# Altium schematic sheet MSXII_DC-DC_Converter.SchDoc: MSXII DC-DC Converter
size Letter; SheetNumber: 1; SheetTotal: 1; Website: www.uwmidsun.com
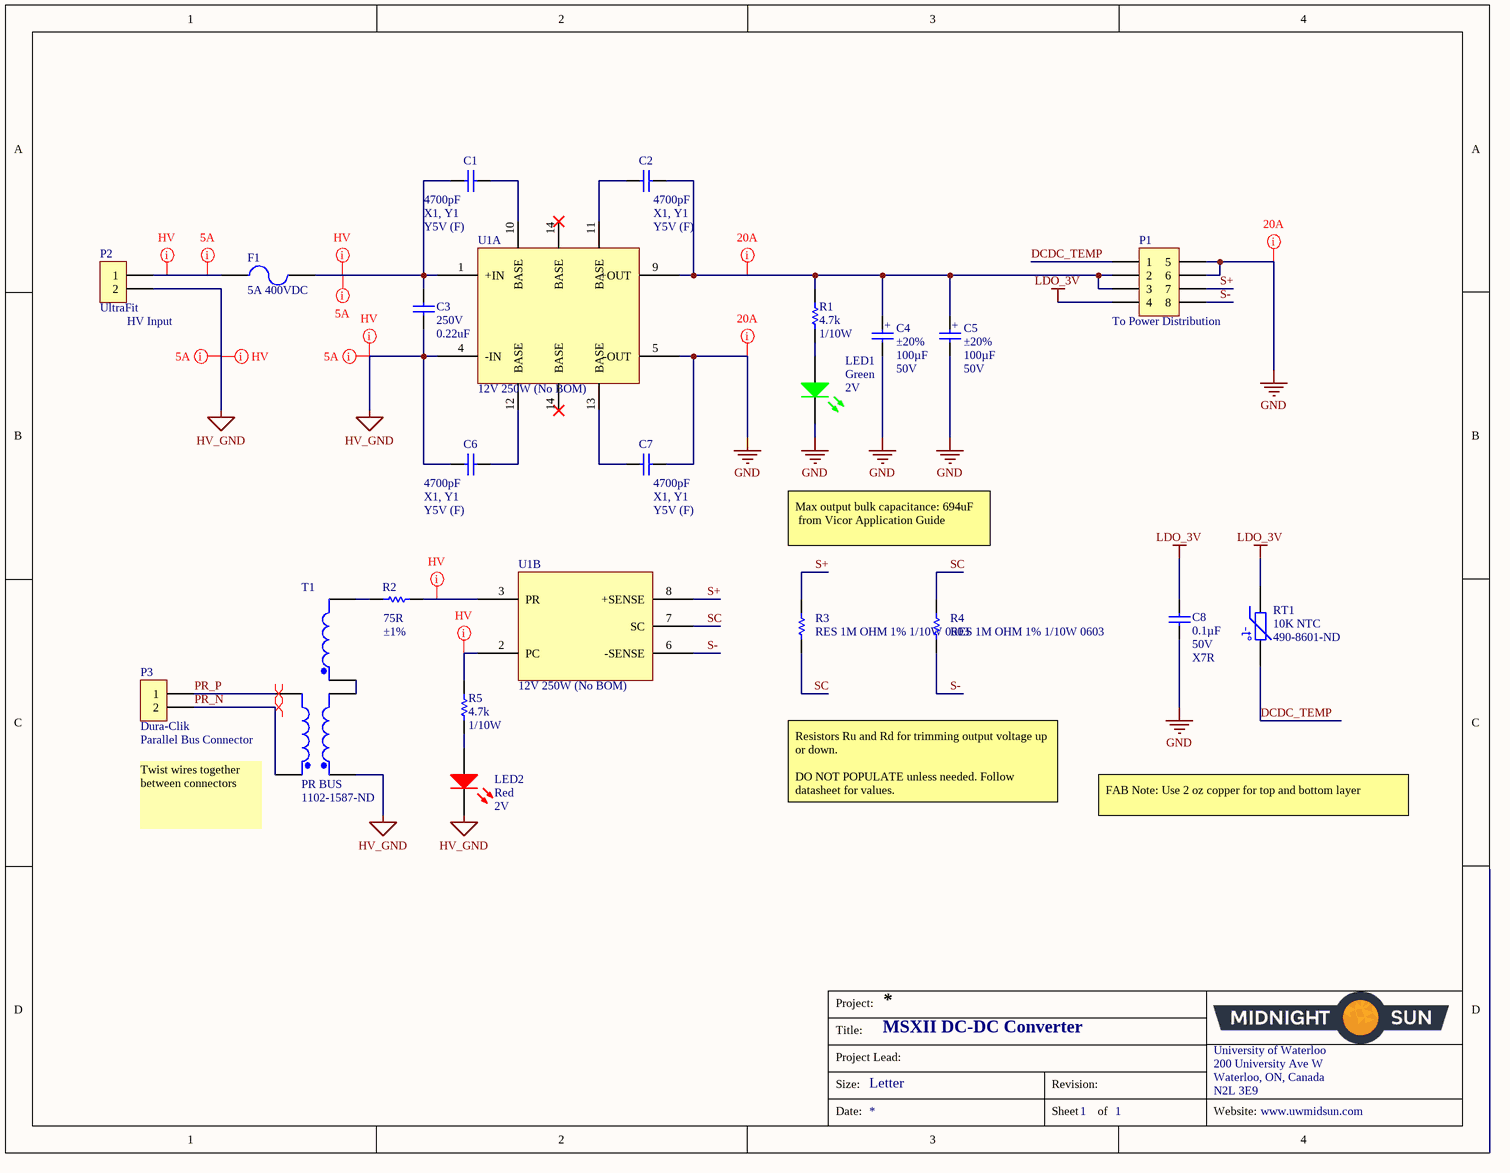
[diagram p0: MSXII_DC-DC_Converter.SchDoc]

## Parts
C1  value 4700pF  Temperature Coefficient: Y5V (F)  Ratings: X1, Y1  [CAP 4700PF 400VAC Y5V RADIAL]  (hidden comment: CAP CER 4700PF 400VAC Y5V RADIAL)
C2  value 4700pF  Temperature Coefficient: Y5V (F)  Ratings: X1, Y1  [CAP 4700PF 400VAC Y5V RADIAL]  (hidden comment: CAP CER 4700PF 400VAC Y5V RADIAL)
C3  value 0.22uF  Voltage Rating - DC: 250V  [CAP FILM 0.22UF 5% 250VDC RADIAL]  (hidden comment: CAP FILM 0.22UF 5% 250VDC RADIAL)
C4  Tolerance: ±20%  Capacitance: 100µF  Voltage Rating: 50V  [CAP ALUM 100UF 50V]  (hidden comment: CAP ALUM 100UF 20% 50V RADIAL)
C5  Tolerance: ±20%  Capacitance: 100µF  Voltage Rating: 50V  [CAP ALUM 100UF 50V]  (hidden comment: CAP ALUM 100UF 20% 50V RADIAL)
C6  value 4700pF  Temperature Coefficient: Y5V (F)  Ratings: X1, Y1  [CAP 4700PF 400VAC Y5V RADIAL]  (hidden comment: CAP CER 4700PF 400VAC Y5V RADIAL)
C7  value 4700pF  Temperature Coefficient: Y5V (F)  Ratings: X1, Y1  [CAP 4700PF 400VAC Y5V RADIAL]  (hidden comment: CAP CER 4700PF 400VAC Y5V RADIAL)
C8  Capacitance: 0.1µF  Voltage: 50V  Temperature Coefficient: X7R  [CAP, 0603]  (hidden comment: CAP CER 0.1UF 50V 10% X7R 0603)
F1  5A 400VDC  [FUSE 5A 400VDC RADIAL]
LED1  Color: Green  Voltage - Forward (Vf) (Typ): 2V  [LED_0603]  (hidden comment: LED GREEN CLEAR 2V 0603)
LED2  Color: Red  Voltage - Forward (Vf) (Typ): 2V  [LED_0603]  (hidden comment: LED RED CLEAR 2V 0603)
P1  CONN 8POS ULTRA-FIT 0.138"  [CONN, 8POS ULTRA-FIT]  (value not drawn)
P2  Series: UltraFit  [CONN, 2POS ULTRA-FIT]  (hidden comment: CONN 2POS ULTRA-FIT 0.138")
P3  Dura-Clik  [CONN, 2POS Dura-Click Vertical]
R1  Resistance (Ohms): 4.7k  Power (Watts): 1/10W  [RES, 0603]  (hidden comment: RES 4.7K OHM 1% 1/10W 0603)
R2  value 75R  Tolerance: ±1%  [RES, 0603]  (hidden comment: RES 75R OHM 1% 1/10W 0603)
R3  RES 1M OHM 1% 1/10W 0603  [RES, 0603]  (no BOM)
R4  RES 1M OHM 1% 1/10W 0603  [RES, 0603]  (no BOM)
R5  Resistance (Ohms): 4.7k  Power (Watts): 1/10W  [RES, 0603]  (hidden comment: RES 4.7K OHM 1% 1/10W 0603)
RT1  10K NTC  Supplier Part Number 1: 490-8601-ND  [NTC THERMISTOR BEAD]
T1  PR BUS  Supplier Part Number 1: 1102-1587-ND  [XFMR PR BUS]  (no BOM)
U1  12V 250W (No BOM)  [DCDC VICOR 150V-12V 250W]  (parts A,B of 2)  (no BOM)

## Nets
GND: C4.2 C5.2 C7.2 C8.2 LED1.2(K) P1.5 P1.6 U1.5(-OUT)
HV_GND: C3.1 C6.1 LED2.2(K) P2.2 T1.1(Pri+) U1.4(-IN)
LDO_3V: C8.1 P1.4 RT1.1
DCDC_TEMP: P1.1 RT1.2
PR_N: P3.2 T1.5(Sec1+)
PR_P: P3.1 T1.6(Sec1-)
S+: P1.7 R3.1 U1.8(+SENSE)
S-: P1.8 R4.2 U1.6(-SENSE)
SC: R3.2 R4.1 U1.7(SC)
NetC1_1: C1.1 C3.2 F1.2 U1.1(+IN)
NetC1_2: C1.2 U1.10(BASE)
NetC2_1: C2.1 U1.11(BASE)
NetC2_2: C2.2 C4.1 C5.1 P1.2 P1.3 R1.1 U1.9(+OUT)
NetC6_2: C6.2 U1.12(BASE)
NetC7_1: C7.1 U1.13(BASE)
NetF1_1: F1.1 P2.1
NetLED1_1: LED1.1(A) R1.2
NetLED2_1: LED2.1(A) R5.2
NetR2_1: R2.1 T1.4(Sec2-)
NetR2_2: R2.2 U1.3(PR)
NetR5_1: R5.1 U1.2(PC)
NetT1_2: T1.2(Pri-) T1.3(Sec2+)

Not connected (* = marked no-connect by the designer): U1 14(BASE)*

## Layout directives
net class HV: HV_GND, NetC1_1, NetF1_1, NetR2_2, NetR5_1
net class 20A: GND, NetC2_2
differential pair: PR_N, PR_P
net class 5A: HV_GND, NetC1_1, NetF1_1

## Notes on the sheet
- (near P2) HV Input
- (near P1) To Power Distribution
- Max output bulk capacitance: 694uF
  from Vicor Application Guide
- Parallel Bus Connector
- Twist wires together between connectors
- Resistors Ru and Rd for trimming output voltage up or down.
  DO NOT POPULATE unless needed. Follow datasheet for values.
- FAB Note: Use 2 oz copper for top and bottom layer
- Project:
- Title:
- Size:
- Project Lead:
- Letter
- Revision:
- University of Waterloo
- 200 University Ave W
- Waterloo, ON, Canada
- N2L 3E9
- Date:
- Sheet
- of
- Website:
- (in symbol CAP ALUM 100UF 20% 50V RADIAL) +
- (in symbol NTC THERMISTOR 10K 1% BEAD) -t°

## Library data of the parts
C1 C2 C6 C7 = CAP CER 4700PF 400VAC Y5V RADIAL: 4700pF ±20% 400VAC Ceramic Capacitor Y5V (F) Radial, Disc; Manufacturer: KEMET; Manufacturer Part Number: C951U472MVVDBA7317; Supplier 1: Digi-Key; RoHS: RoHS Compliant; Category: Capacitors; Stock 1: 9713; Pricing 1: 1=1.12, 10=0.795, 100=0.5234, 500=0.38772 (CAD); Packaging: Cut Tape (CT); Part Status: Active; Tolerance: ±20%; Voltage - Rated: 400VAC; Operating Temperature: -40°C ~ 125°C; Features: -; Applications: Safety; Failure Rate: -; Mounting Type: Through Hole; Package / Case: Radial, Disc; Size / Dimension: 0.472" Dia (12.00mm); Height - Seated (Max): -; Thickness (Max): -; Lead Spacing: 0.394" (10.00mm); Lead Style: Formed Leads - Kinked; ComponentLink1URL: https://search.kemet.com/component-edge/download/datasheet/C951U472MVVDBA7317.pdf; ComponentLink1Description: https://search.kemet.com/component-edge/download/datasheet/C951U472MVVDBA7317.pdf; Supplier Part Number 1: 399-9517-1-ND
C3 = CAP FILM 0.22UF 5% 250VDC RADIAL: 0.22µF Film Capacitor 140V 250V Polyester, Polyethylene Terephthalate (PET), Metallized - Stacked Radial; Manufacturer: KEMET; Manufacturer Part Number: R82IC3220AA60J; Supplier 1: Digi-Key; RoHS: RoHS Compliant; Category: Capacitors; Stock 1: 6730; Pricing 1: 1=0.82, 10=0.581, 100=0.382, 500=0.28302, 1000=0.24056, 2500=0.22641, 5000=0.21226 (CAD); Packaging: Bulk; Part Status: Active; Tolerance: ±5%; Voltage Rating - AC: 140V; Dielectric Material: Polyester, Polyethylene Terephthalate (PET), Metallized - Stacked; Operating Temperature: -55°C ~ 105°C; Mounting Type: Through Hole; Package / Case: Radial; Size / Dimension: 0.283" L x 0.236" W (7.20mm x 6.00mm); Height - Seated (Max): 0.437" (11.10mm); Termination: PC Pins; Lead Spacing: 0.197" (5.00mm); Applications: Automotive; Ratings: AEC-Q200; Features: -; ComponentLink1URL: https://search.kemet.com/component-edge/download/datasheet/R82IC3220AA60J.pdf; ComponentLink1Description: https://search.kemet.com/component-edge/download/datasheet/R82IC3220AA60J.pdf; Supplier Part Number 1: 399-6046-ND
C4 C5 = CAP ALUM 100UF 20% 50V RADIAL: 100µF 50V Aluminum Capacitors Radial, Can 74 mOhm @ 100kHz 3000 Hrs @ 105°C; Manufacturer 1: KEMET; Manufacturer Part Number 1: ESY107M050AG3AA; Polarization: Polar; Ripple Current - Low Frequency: 511mA @ 120Hz; Ripple Current - High Frequency: 730mA @ 100kHz; Impedance: 74 mOhm; Supplier 1: Digi-Key; Supplier Part Number 1: 399-6119-ND; RoHS: RoHS Compliant; Description 1: CAP ALUM 100UF 20% 50V RADIAL; Category: Capacitors; Stock 1: 7068; Pricing 1: 1=0.5, 10=0.345, 100=0.2074, 500=0.15558, 1000=0.13138, 2500=0.12446, 5000=0.11755 (CAD); Packaging: Bulk; Part Status: Active; ESR (Equivalent Series Resistance): 74 mOhm @ 100kHz; Lifetime @ Temp.: 3000 Hrs @ 105°C; Operating Temperature: -40°C ~ 105°C; Applications: General Purpose; Lead Spacing: 0.138" (3.50mm); Size / Dimension: 0.315" Dia (8.00mm); Height - Seated (Max): 0.492" (12.50mm); Surface Mount Land Size: -; Mounting Type: Through Hole; Package / Case: Radial, Can; ComponentLink1URL: http://capacitoredge.kemet.com/capedge2/DataSheet?pn=ESY107M050AG3AA; ComponentLink1Description: http://capacitoredge.kemet.com/capedge2/DataSheet?pn=ESY107M050AG3AA
C8 = CAP CER 0.1UF 50V 10% X7R 0603: 0.10µF ±10% 50V Ceramic Capacitor X7R 0603 (1608 Metric); Manufacturer 1: AVX Corporation; Manufacturer Part Number 1: 06035C104KAT2A; Supplier 1: Digi-Key; Supplier Part Number 1: 478-5052-1-ND; Packaging: Cut Tape (CT); Part Status: Active; Operating Temperature: -55°C ~ 125°C; Ratings: -; Mounting Type: Surface Mount, MLCC; Package / Case: 0603 (1608 Metric); Size / Dimension: 0.063" L x 0.032" W (1.60mm x 0.81mm); Height - Seated (Max): -; Thickness (Max): 0.035" (0.90mm); Lead Spacing: -; Lead Style: -; ComponentLink1URL: http://datasheets.avx.com/X7RDielectric.pdf; ComponentLink1Description: http://datasheets.avx.com/X7RDielectric.pdf; Tolerance: ±10%
F1 = FUSE 5A 125VAC/400VDC RADIAL: FUSE BOARD MNT 5A 125VAC/400VDC; Manufacturer: Eaton; Manufacturer Part Number: BK/PCE-5-R; Fuse Type: Board Mount (Cartridge Style Excluded); Response Time: Fast; Breaking Capacity @ Rated Voltage: 10kA AC, 4.2kA DC; Approvals: CSA, UL; Supplier 1: Digi-Key; RoHS: RoHS Compliant; Category: Circuit Protection; Stock 1: 0; Pricing 1: 1=3.06, 5=2.91, 10=2.765, 50=2.2306, 100=1.8911, 250=1.8426, 500=1.55166, 1000=1.38196, 5000=1.21224 (CAD); Packaging: Bulk; Part Status: Active; Package / Case: Radial, Box; Mounting Type: Through Hole; Operating Temperature: -; Color: -; Size / Dimension: 0.300" L x 0.095" W x 0.170" H (7.62mm x 2.41mm x 4.32mm); ComponentLink1URL: http://www.cooperindustries.com/content/dam/public/bussmann/Electronics/Resources/product-datasheets/Bus_Elx_DS_2034_PC_Tron_Series.pdf; ComponentLink1Description: http://www.cooperindustries.com/content/dam/public/bussmann/Electronics/Resources/product-datasheets/Bus_Elx_DS_2034_PC_Tron_Series.pdf; Supplier Part Number 1: 283-2770-ND
LED1 = LED GREEN CLEAR 2V 0603: Green 572nm LED Indication - Discrete 2V 0603 (1608 Metric); Manufacturer: Wurth Electronics Inc.; Manufacturer Part Number: 150060VS75000; Lens Color: Colorless; Millicandela Rating: 40mcd; Lens Style/Size: Rectangle with Flat Top, 1.10mm x 0.70mm; Current - Test: 20mA; Viewing Angle: 140°; Wavelength - Dominant: 570nm; Supplier 1: Digi-Key; RoHS: RoHS Compliant; Category: Optoelectronics; Stock 1: 9408; Pricing 1: 1=0.21, 100=0.1617, 500=0.13964 (CAD); Packaging: Cut Tape (CT); Part Status: Active; Lens Transparency: Clear; Mounting Type: Surface Mount; Wavelength - Peak: 572nm; Features: -; Package / Case: 0603 (1608 Metric); Supplier Device Package: 0603; Size / Dimension: 1.60mm L x 0.80mm W; Height (Max): 0.80mm; ComponentLink1URL: http://katalog.we-online.de/led/datasheet/150060VS75000.pdf; ComponentLink1Description: http://katalog.we-online.de/led/datasheet/150060VS75000.pdf; Supplier Part Number 1: 732-4980-1-ND
LED2 = LED RED CLEAR 2V 0603: Red 631nm LED Indication - Discrete 2V 0603 (1608 Metric); Manufacturer: Wurth Electronics Inc.; Manufacturer Part Number: 150060RS75000; Lens Color: Colorless; Millicandela Rating: 250mcd; Lens Style/Size: Rectangle with Flat Top, 1.10mm x 0.70mm; Current - Test: 20mA; Viewing Angle: 140°; Wavelength - Dominant: 625nm; Wavelength - Peak: 630nm; Supplier 1: Digi-Key; RoHS: RoHS Compliant; Category: Optoelectronics; Stock 1: 35521; Pricing 1: 1=0.21, 100=0.1617, 500=0.13964 (CAD); Packaging: Cut Tape (CT); Part Status: Active; Lens Transparency: Clear; Mounting Type: Surface Mount; Features: -; Package / Case: 0603 (1608 Metric); Supplier Device Package: 0603; Size / Dimension: 1.60mm L x 0.80mm W; Height (Max): 0.80mm; ComponentLink1URL: http://katalog.we-online.de/led/datasheet/150060RS75000.pdf; ComponentLink1Description: http://katalog.we-online.de/led/datasheet/150060RS75000.pdf; Supplier Part Number 1: 732-4978-1-ND
P1 = CONN 8POS ULTRA-FIT 0.138": 8 Positions Header Connector 0.138" (3.50mm) Through Hole Tin; Manufacturer: Molex, LLC; Manufacturer Part Number: 1722991108; Style: Board to Cable/Wire; Shrouding: Shrouded - 4 Wall; Number of Positions: 8; Number of Positions Loaded: All; Row Spacing - Mating: 0.181" (4.60mm); Contact Length - Post: 0.126" (3.20mm); Material Flammability Rating: UL94 V-0; Voltage Rating: 400V; Mated Stacking Heights: 26.99mm; Supplier 1: Digi-Key; RoHS: RoHS Compliant; Category: Connectors, Interconnects; Stock 1: 60; Pricing 1: 1=2.12, 10=1.923, 50=1.7262, 100=1.6478, 250=1.49084, 500=1.37314, 1000=1.17697, 2500=1.0985, 5000=1.04358 (CAD); Packaging: Tray; Part Status: Active; Connector Type: Header; Contact Type: Male Pin; Pitch - Mating: 0.138" (3.50mm); Number of Rows: 2; Mounting Type: Through Hole; Termination: Solder; Fastening Type: Latch Holder; Contact Length - Mating: -; Overall Contact Length: -; Insulation Height: 0.465" (11.80mm); Contact Shape: Square; Contact Finish - Mating: Tin; Contact Finish Thickness - Mating: 60µin (1.52µm); Contact Finish - Post: Tin; Contact Material: Copper Alloy; Insulation Material: Liquid Crystal Polymer (LCP); Features: Board Guide, Solder Retention; Operating Temperature: -40°C ~ 105°C; Ingress Protection: -; Insulation Color: Black; Current Rating: -; Contact Finish Thickness - Post: 60µin (1.52µm); Applications: Automotive, General Purpose, Industrial, Lighting, Medical, Military, Telecommunications; ComponentLink1URL: http://www.molex.com/pdm_docs/sd/1722991108_sd.pdf; ComponentLink1Description: http://www.molex.com/pdm_docs/sd/1722991108_sd.pdf; Supplier Part Number 1: WM11779-ND
P2 = CONN 2POS ULTRA-FIT 0.138": 2 Positions Header, Shrouded Connector 0.138" (3.50mm) Through Hole Gold; Manufacturer 1: Molex, LLC; Manufacturer Part Number 1: 1722861302; Style: Board to Board or Cable; Shrouding: Shrouded - 4 Wall; Number of Positions: 2; Number of Positions Loaded: All; Contact Length - Post: 0.126" (3.20mm); Material Flammability Rating: UL94 V-0; Mated Stacking Heights: 26.99mm; Voltage: 400V; Supplier 1: Digi-Key; Supplier Part Number 1: WM11673-ND; Packaging: Tray; Part Status: Active; Connector Type: Header; Contact Type: Male Pin; Pitch - Mating: 0.138" (3.50mm); Number of Rows: 1; Row Spacing - Mating: -; Mounting Type: Through Hole; Termination: Kinked Pin, Solder; Fastening Type: Latch Holder; Contact Length - Mating: -; Overall Contact Length: -; Insulation Height: 0.465" (11.80mm); Contact Shape: Square; Contact Finish - Mating: Gold; Contact Finish Thickness - Mating: 30µin (0.76µm); Contact Finish - Post: Tin; Contact Material: Copper Alloy; Insulation Material: Liquid Crystal Polymer (LCP); Operating Temperature: -40°C ~ 120°C; Ingress Protection: -; Insulation Color: Black; Current Rating: -; Contact Finish Thickness - Post: 60µin (1.52µm); ComponentLink1URL: http://www.molex.com/pdm_docs/sd/1722861302_sd.pdf; ComponentLink1Description: http://www.molex.com/pdm_docs/sd/1722861302_sd.pdf
P3 = CONN 2POS DURA-CLIK 0.079" VERT: 2 Positions Header, Shrouded Connector 0.079" (2.00mm) Surface Mount, Vertical Tin; Manufacturer: Molex, LLC; Manufacturer Part Number: 5600200220; Style: Board to Cable/Wire; Shrouding: Shrouded - 4 Wall; Number of Positions: 2; Number of Positions Loaded: All; Mated Stacking Heights: 9.3mm; Supplier 1: Digi-Key; RoHS: RoHS Compliant; Category: Connectors, Interconnects; Stock 1: 11912; Pricing 1: 1=1.16, 10=1.012, 25=0.952, 50=0.9122, 100=0.8727, 250=0.79336 (CAD); Packaging: Cut Tape (CT); Part Status: Active; Connector Type: Header; Contact Type: Male Pin; Pitch - Mating: 0.079" (2.00mm); Number of Rows: 1; Row Spacing - Mating: -; Mounting Type: Surface Mount; Termination: Solder; Fastening Type: Latch Lock; Contact Length - Mating: -; Contact Length - Post: -; Overall Contact Length: -; Insulation Height: 0.315" (8.00mm); Contact Shape: Square; Contact Finish - Mating: Tin; Contact Finish Thickness - Mating: -; Contact Finish - Post: Tin; Contact Material: Copper Alloy; Insulation Material: Polyamide (PA), Nylon; Features: Solder Retention; Operating Temperature: -; Ingress Protection: -; Material Flammability Rating: -; Insulation Color: Natural; Current Rating: -; Voltage Rating: -; Contact Finish Thickness - Post: -; Applications: Automotive, Industrial; ComponentLink1URL: http://www.molex.com/pdm_docs/sd/5600200220_sd.pdf; ComponentLink1Description: http://www.molex.com/pdm_docs/sd/5600200220_sd.pdf; Supplier Part Number 1: WM10862CT-ND
R1 R5 = RES 4.7K OHM 1% 1/10W 0603: 4.7k Ohm ±1% 0.1W, 1/10W Chip Resistor 0603 (1608 Metric) Moisture Resistant Thick Film; Manufacturer 1: Yageo; Manufacturer Part Number 1: RC0603FR-074K7L; Description 1: RES SMD 4.7K OHM 1% 1/10W 0603; Temperature Coefficient: ±100ppm/°C; Supplier 1: Digi-Key; Supplier Part Number 1: 311-4.70KHRCT-ND; RoHS: RoHS Compliant; Category: Resistors; Stock 1: 3487566; Pricing 1: 1=0.16, 10=0.022, 100=0.0089, 1000=0.00402, 2500=0.00349 (CAD); Packaging: Cut Tape (CT); Part Status: Active; Composition: Thick Film; Features: Moisture Resistant; Operating Temperature: -55°C ~ 155°C; Package / Case: 0603 (1608 Metric); Supplier Device Package: 0603; Size / Dimension: 0.063" L x 0.031" W (1.60mm x 0.80mm); Height - Seated (Max): 0.022" (0.55mm); Failure Rate: -; ComponentLink1URL: http://www.yageo.com/documents/recent/PYu-RC_Group_51_RoHS_L_7.pdf; ComponentLink1Description: http://www.yageo.com/documents/recent/PYu-RC_Group_51_RoHS_L_7.pdf; Tolerance: ±1%
R2 = RES 75R OHM 1% 1/10W 0603: 75 Ohms ±1% 0.1W, 1/10W Chip Resistor 0603 (1608 Metric) Automotive AEC-Q200, Moisture Resistant Thick Film; Manufacturer: Yageo; Manufacturer Part Number: AC0603FR-0775RL; Temperature Coefficient: ±100ppm/°C; Supplier 1: Digi-Key; RoHS: RoHS Compliant; Category: Resistors; Stock 1: 20391; Pricing 1: 1=0.15, 10=0.036, 100=0.0145, 1000=0.00652, 2500=0.00566 (CAD); Packaging: Cut Tape (CT); Part Status: Active; Power (Watts): 0.1W, 1/10W; Composition: Thick Film; Features: Automotive AEC-Q200, Moisture Resistant; Operating Temperature: -55°C ~ 155°C; Package / Case: 0603 (1608 Metric); Supplier Device Package: 0603; Size / Dimension: 0.063" L x 0.032" W (1.60mm x 0.80mm); Height - Seated (Max): 0.022" (0.55mm); Failure Rate: -; ComponentLink1URL: http://www.yageo.com/NewPortal/yageodocoutput?fileName=/pdf/R-Chip/PYu-AC_51_RoHS_L_6.pdf; ComponentLink1Description: http://www.yageo.com/NewPortal/yageodocoutput?fileName=/pdf/R-Chip/PYu-AC_51_RoHS_L_6.pdf; Supplier Part Number 1: YAG3630CT-ND
R3 R4 = RES 1M OHM 1% 1/10W 0603: 1M Ohm ±1% 0.1W, 1/10W Chip Resistor 0603 (1608 Metric) Moisture Resistant Thick Film; Manufacturer 1: Yageo; Manufacturer Part Number 1: RC0603FR-071ML; Description 1: RES SMD 1M OHM 1% 1/10W 0603; Temperature Coefficient: ±100ppm/°C; Supplier 1: Digi-Key; Supplier Part Number 1: 311-1.00MHRCT-ND; RoHS: RoHS Compliant; Category: Resistors; Stock 1: 2336711; Pricing 1: 1=0.16, 10=0.022, 100=0.0089, 1000=0.00402, 2500=0.00349 (CAD); Packaging: Cut Tape (CT); Part Status: Active; Composition: Thick Film; Features: Moisture Resistant; Operating Temperature: -55°C ~ 155°C; Package / Case: 0603 (1608 Metric); Supplier Device Package: 0603; Size / Dimension: 0.063" L x 0.031" W (1.60mm x 0.80mm); Height - Seated (Max): 0.022" (0.55mm); Failure Rate: -; ComponentLink1URL: http://www.yageo.com/documents/recent/PYu-RC_Group_51_RoHS_L_7.pdf; ComponentLink1Description: http://www.yageo.com/documents/recent/PYu-RC_Group_51_RoHS_L_7.pdf; Tolerance: ±1%; Resistance (Ohms): 1M; Power (Watts): 1/10W
RT1 = NTC THERMISTOR 10K 1% BEAD: NTC Thermistor 10k Bead; Manufacturer: Murata Electronics North America; Manufacturer Part Number: NXRT15XH103FA1B030; Resistance Tolerance: ±1%; B25/50: 3380K; B25/85: 3434K; B25/100: 3455K; Supplier 1: Digi-Key; RoHS: RoHS Compliant; Category: Sensors, Transducers; Stock 1: 25017; Pricing 1: 1=0.96, 5=0.91, 10=0.792, 25=0.696, 50=0.5784, 100=0.4925, 500=0.42834, 1000=0.3748, 5000=0.33197 (CAD); Packaging: Bulk; Part Status: Active; Resistance in Ohms @ 25°C: 10k; B Value Tolerance: ±1%; B0/50: -; B25/75: -; Operating Temperature: -40°C ~ 125°C; Length - Lead Wire: -; Mounting Type: Through Hole; Package / Case: Bead; ComponentLink1URL: https://www.murata.com/~/media/webrenewal/support/library/catalog/products/thermistor/ntc/r44e.ashx; ComponentLink1Description: https://www.murata.com/~/media/webrenewal/support/library/catalog/products/thermistor/ntc/r44e.ashx
T1 = XFMR PR BUS: Transformer for PR bus on Vicor DC-DC; Manufacturer: Vicor Corporation; Manufacturer Part Number: 29768; For Use With/Related Products: VICOR Maxi, Mini, Micro-Sized Modules; Supplier 1: Digi-Key; RoHS: RoHS Compliant; Category: Power Supplies - Board Mount; Stock 1: 2198; Pricing 1: 1=15.2, 10=13.82, 25=12.7844, 100=11.7476, 250=10.711, 500=10.01996, 1000=9.19073 (CAD); Part Status: Active; Accessory Type: Transformer; ComponentLink1URL: http://asp.vicorpower.com/CADPDF/899N5I.PDF; ComponentLink1Description: http://asp.vicorpower.com/CADPDF/899N5I.PDF
U1 = DCDC VICOR 150V-12V 250W: Isolated Module DC DC Converter 1 Output 12V 20.83A 100V - 200V Input; Manufacturer: Vicor Corporation; Manufacturer Part Number: V150B12C250BL; Number of Outputs: 1; Voltage - Isolation: 3kV (3000V); Efficiency: 88.1%; Supplier 1: Digi-Key; RoHS: RoHS non-compliant; Category: Power Supplies - Board Mount; Stock 1: 0; Pricing 1: 1=252.65 (CAD); Packaging: Bulk; Part Status: Active; Type: Isolated Module; Voltage - Input (Min): 100V; Voltage - Input (Max): 200V; Voltage - Output 1: 12V; Voltage - Output 2: -; Voltage - Output 3: -; Current - Output (Max): 20.83A; Applications: ITE (Commercial); Features: OVP, UVLO; Operating Temperature: -20°C ~ 100°C; Mounting Type: Through Hole; Package / Case: 9-DIP Module; Size / Dimension: 2.28" L x 2.20" W x 0.50" H (57.9mm x 55.9mm x 12.7mm); ComponentLink1URL: http://cdn.vicorpower.com/documents/datasheets/ds_150vin-mini-family.pdf; ComponentLink1Description: http://cdn.vicorpower.com/documents/datasheets/ds_150vin-mini-family.pdf; Supplier Part Number 1: 1102-1234-ND